# EasyEDA Pro project ProPrj_F1C200S_2026-01-27.epro, board PCB1
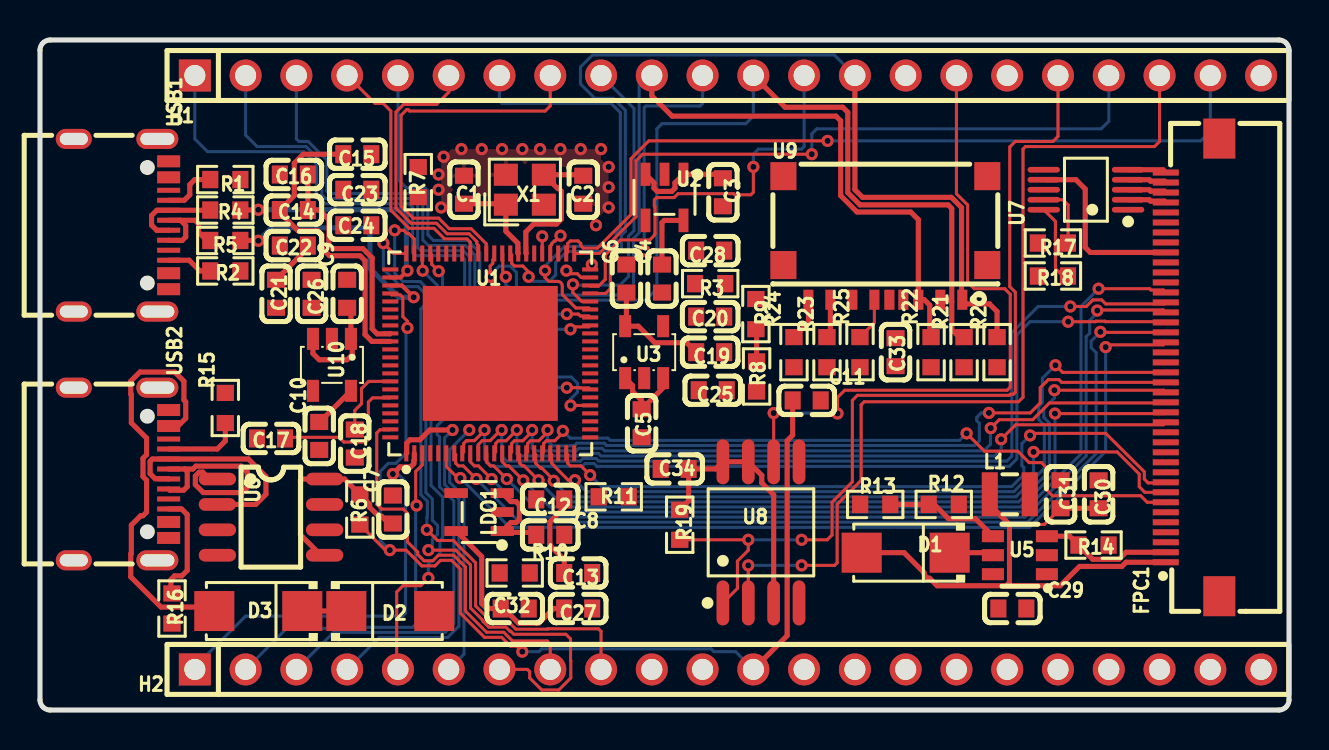
[diagram p1: board, top side]
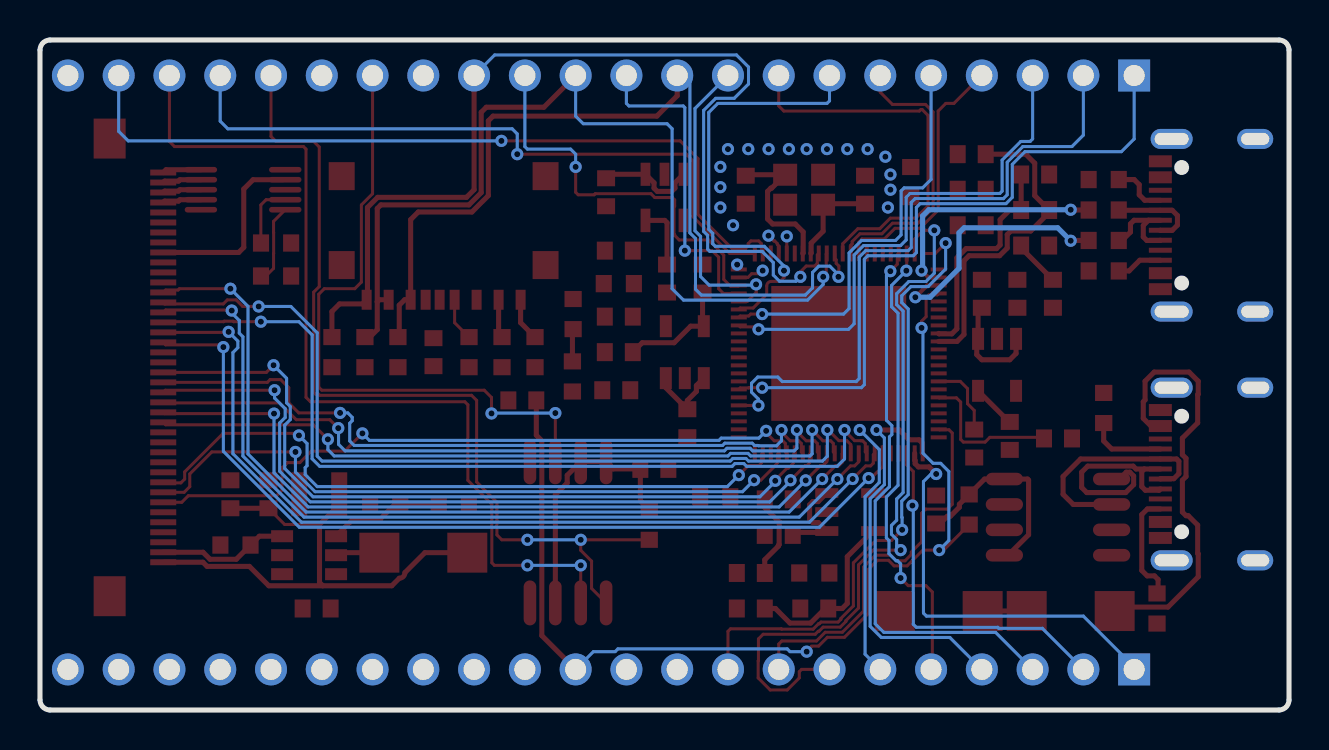
[diagram p2: board, bottom side, seen from below]

Outline 62.48 x 33.53 mm; copper layers: Top Layer, Inner1, Inner2, Bottom Layer. Coordinates in mm from the lower left corner of the outline.
Outline path: 0,33.02 0,0.51 arc(0.15,0.15) 0.51,0 61.98,0 arc(62.34,0.15) 62.48,0.51 62.48,33.02 arc(62.34,33.38) 61.98,33.53 0.51,33.53 arc(0.15,33.38) 0,33.02
Stack: Top Layer 0.035mm Outer layer thickness 1oz / Dielectric1 0.2104mm 7628 RC49% 8.6mil / Inner1 0.0152mm Inner layer thickness / Dielectric2 1.065mm 1.1mm H/HOZ Copper / Inner2 0.0152mm Inner layer thickness / Dielectric3 0.2104mm 7628 RC49% 8.6mil / Bottom Layer 0.035mm Outer layer thickness 1oz

## Design rules (mm)
net D1-: DP3
net D1+: DP3
net USB_DM: DP4
net USB_DP: DP4
spacing copperThickness1oz (default): track to track 0.102, other pairs 0.102 to 0.3
spacing copperThickness2oz: track to track 0.203, other pairs 0.152 to 0.3
track width copperThickness1oz (default): min 0.127, default 0.152, max 2.54
track width copperThickness2oz: min 0.203, default 0.254, max 2.54
differential pair differentialPair (default): width min 0.127, default 0.254, max 2.54; gap min 0.152, default 0.152
net GND uses copperRegion

## Placement (name value [footprint] x y rotation side)
C1  22pF  [C0603]  21.21 26.04 90 top
C2  22pF  [C0603]  27.18 26.04 90 top
C3  1uF  [C0603]  34.16 25.91 90 top
C4  10uF  [C0603]  31.12 21.59 90 top
C5  1uF  [C0603]  30.1 14.35 90 top
C6  10uF  [C0603]  29.34 21.59 270 top
C7  10uF  [C0603]  17.65 10.03 270 top
C8  1uF  [C0603]  25.53 8.76 180 top
C9  1uF  [C0603]  15.37 20.83 270 top
C10  10uF  [C0603]  13.97 13.72 90 top
C11  100nF  [C0603]  38.35 15.49 0 top
C12  100nF  [C0603]  25.53 10.54 0 top
C13  100nF  [C0603]  26.92 6.86 0 top
C14  10uF  [C0603]  12.7 25.02 0 top
C15  10uF  [C0603]  15.88 27.81 180 top
C16  10uF  [C0603]  12.7 26.8 0 top
C17  1uF  [C0603]  11.56 13.59 0 top
C18  1uF  [C0603]  15.75 13.34 90 top
C19  100nF  [C0603]  33.53 17.91 180 top
C20  1uF  [C0603]  33.53 19.69 180 top
C21  100nF  [C0603]  11.81 20.83 90 top
C22  10uF  [C0603]  12.7 23.24 0 top
C23  100nF  [C0603]  15.88 26.04 0 top
C24  10uF  [C0603]  15.88 24.26 0 top
C25  100nF  [C0603]  33.66 16 180 top
C26  100nF  [C0603]  13.59 20.83 270 top
C27  10uF  [C0603]  26.92 5.08 180 top
C28  100nF  [C0603]  33.53 22.99 180 top
C29  10uF  [C0603]  48.64 5.08 180 top
C30  10uF  [C0603]  52.96 10.8 90 top
C31  100nF  [C0603]  51.05 10.8 90 top
C32  100nF  [C0603]  23.75 5.08 180 top
C33  10uF  [C0603]  42.8 17.91 270 top
C34  100nF  [C0603]  31.75 12.07 0 top
D1  SS14  [SMA_L4.3-W2.6-LS5.2-RD]  43.31 7.87 180 top
D2  SS14  [SMA_L4.3-W2.6-LS5.2-RD]  17.53 4.95 0 top
D3  SS14  [SMA_L4.3-W2.6-LS5.2-RD]  10.92 4.95 180 top
FPC1  AFC01-S40FCA-00  [FPC-SMD_AFC01-S40FCA-00]  57.66 17.15 90 top
H1  X6511WV-22H-C60D30  [HDR-TH_22P-P2.54-V-M]  34.42 31.75 0 top
H2  X6511WV-22H-C60D30  [HDR-TH_22P-P2.54-V-M]  34.42 2.03 0 top
L1  2.2uH  [IND-SMD_L2.5-W2.0_MHCHL2520]  48.51 10.8 0 top
LDO1  ME6211C33M5G-N  [SOT-23-5_L3.0-W1.7-P0.95-LS2.8-BL]  21.97 9.91 90 top
R1  5.1kΩ  [R0603]  9.27 26.54 180 top
R2  5.1kΩ  [R0603]  9.27 21.97 180 top
R3  47kΩ  [R0603]  33.53 21.34 0 top
R4  22Ω  [R0603]  9.27 25.02 180 top
R5  22Ω  [R0603]  9.27 23.5 180 top
R6  47kΩ  [R0603]  16 10.03 270 top
R7  0Ω  [R0603]  18.92 26.42 90 top
R8  2kΩ  [R0603]  35.85 16.69 90 top
R9  2kΩ  [R0603]  35.81 19.81 90 top
R10  200kΩ  [R0603]  23.75 6.86 180 top
R11  200kΩ  [R0603]  28.7 10.67 0 top
R12  10kΩ  [R0603]  45.21 10.29 180 top
R13  0Ω  [R0603]  41.78 10.29 0 top
R14  5.1Ω  [R0603]  52.71 8.26 180 top
R15  5.1kΩ  [R0603]  9.27 15.11 270 top
R16  5.1kΩ  [R0603]  6.6 5.08 90 top
R17  4.7kΩ  [R0603]  50.67 23.37 0 top
R18  4.7kΩ  [R0603]  50.67 21.72 0 top
R19  10kΩ  [R0603]  32 9.27 90 top
R20  47kΩ  [R0603]  47.88 17.91 270 top
R21  47kΩ  [R0603]  46.23 17.91 270 top
R22  47kΩ  [R0603]  44.58 17.91 270 top
R23  47kΩ  [R0603]  39.37 17.91 270 top
R24  47kΩ  [R0603]  37.72 17.91 270 top
R25  22Ω  [R0603]  41.02 17.91 90 top
U1  F1C200S  [QFN-88_L10.0-W10.0-P0.40-BL-EP6.75]  22.53 17.84 0 top
U2  ME6211C12M5G-N  [SOT-23-5_L3.0-W1.7-P0.95-LS2.8-BL]  31.24 25.65 180 top
U3  ME6211C25M5G-N  [SOT-23-5_L3.0-W1.7-P0.95-LS2.8-BR]  30.23 17.91 270 top
U5  PT4103B23F  [SOT-23-6_L2.9-W1.6-P0.95-LS2.8-BR]  49.02 7.75 0 top
U6  CH340N  [SOP-8_L4.9-W3.9-P1.27-LS6.0-BL]  11.56 9.65 270 top
U7  NS2009  [MSOP-10_L3.0-W3.0-P0.50-LS5.0-BL]  52.32 26.04 90 top
U8  W25Q128JVSIQ  [SOIC-8_L5.3-W5.3-P1.27-LS8.0-BL]  36.07 8.89 0 top
U9  TF-123-ARP9H17  [TF-SMD_TF-123-ARP9H15]  42.29 23.62 0 top
U10  ME6211C28M5G-N  [SOT-23-5_L3.0-W1.7-P0.95-LS2.8-BR]  14.61 17.27 90 top
USB1  MC-107DMS  [USB-C-SMD_MC-107DMS]  4.06 24.26 270 top
USB2  MC-107DMS  [USB-C-SMD_MC-107DMS]  4.06 11.81 270 top
X1  24MHz  [CRYSTAL-SMD_4P-L2.5-W2.0-BL]  24.26 26.04 0 top

## Footprints (pads in the part's own frame, mm; a bottom-side part is the same pattern mirrored in y, then rotated)
C0603
  rect 0.8x0.9 smd: 1(-0.7,0) 2(0.7,0)
CRYSTAL-SMD_4P-L2.5-W2.0-BL
  rect 1.2x1.1 smd: 1(-0.95,-0.75) 2(0.95,-0.75) 3(0.95,0.75) 4(-0.95,0.75)
FPC-SMD_AFC01-S40FCA-00
  rect 0.3x1.3 smd: 1(-9.75,1.34) 2(-9.25,1.339) 3(-8.75,1.34) 4(-8.25,1.34) 5(-7.75,1.34) 6(-7.25,1.34) 7(-6.75,1.34) 8(-6.25,1.34) 9(-5.75,1.34) 10(-5.25,1.34) 11(-4.75,1.34) 12(-4.25,1.34) 13(-3.75,1.34) 14(-3.25,1.34) 15(-2.75,1.34) 16(-2.25,1.34) 17(-1.75,1.34) 18(-1.25,1.34) 19(-0.75,1.34) 20(-0.25,1.34) 21(0.25,1.34) 22(0.75,1.34) 23(1.25,1.34) 24(1.75,1.34) 25(2.25,1.34) 26(2.75,1.34) 27(3.25,1.34) 28(3.75,1.34) 29(4.25,1.34) 30(4.75,1.34) 31(5.25,1.34) 32(5.75,1.34) 33(6.25,1.34) 34(6.75,1.34) 35(7.25,1.34) 36(7.75,1.34) 37(8.25,1.34) 38(8.75,1.34) 39(9.25,1.34) 40(9.75,1.34)
  rect 2x1.6 smd: 41(-11.45,-1.34) 42(11.45,-1.34)
HDR-TH_22P-P2.54-V-M
  rect 1.6x1.6 hole 1.05: 1(-26.67,0)
  round 1.6 hole 1.05: 2(-24.13,0) 3(-21.59,0) 4(-19.05,0) 5(-16.51,0) 6(-13.97,0) 7(-11.43,0) 8(-8.89,0) 9(-6.35,0) 10(-3.81,0) 11(-1.27,0) 12(1.27,0) 13(3.81,0) 14(6.35,0) 15(8.89,0) 16(11.43,0) 17(13.97,0) 18(16.51,0) 19(19.05,0) 20(21.59,0) 21(24.13,0) 22(26.67,0)
IND-SMD_L2.5-W2.0_MHCHL2520
  rect 0.8x2.2 smd: 1(-1,0) 2(1,0)
MSOP-10_L3.0-W3.0-P0.50-LS5.0-BL
  oval 0.28x1.62 smd: 1(-1,-2.11) 2(-0.5,-2.11) 3(0,-2.11) 4(0.5,-2.11) 5(1,-2.11) 6(1,2.11) 7(0.5,2.11) 8(0,2.11) 9(-0.5,2.11) 10(-1,2.11)
QFN-88_L10.0-W10.0-P0.40-BL-EP6.75
  rect 0.2x0.8 smd: 1(-4.2,-5) 2(-3.8,-5) 3(-3.4,-5) 4(-3,-5) 5(-2.6,-5) 6(-2.2,-5) 7(-1.8,-5) 8(-1.4,-5) 9(-1,-5) 10(-0.6,-5) 11(-0.2,-5) 12(0.2,-5) 13(0.6,-5) 14(1,-5) 15(1.4,-5) 16(1.8,-5) 17(2.2,-5) 18(2.6,-5) 19(3,-5) 20(3.4,-5) 21(3.8,-5) 22(4.2,-5) 45(4.2,5) 46(3.8,5) 47(3.4,5) 48(3,5) 49(2.6,5) 50(2.2,5) 51(1.8,5) 52(1.4,5) 53(1,5) 54(0.6,5) 55(0.2,5) 56(-0.2,5) 57(-0.6,5) 58(-1,5) 59(-1.4,5) 60(-1.8,5) 61(-2.2,5) 62(-2.6,5) 63(-3,5) 64(-3.4,5) 65(-3.8,5) 66(-4.2,5)
  rect 0.8x0.2 smd: 23(5,-4.2) 24(5,-3.8) 25(5,-3.4) 26(5,-3) 27(5,-2.6) 28(5,-2.2) 29(5,-1.8) 30(5,-1.4) 31(5,-1) 32(5,-0.6) 33(5,-0.2) 34(5,0.2) 35(5,0.6) 36(5,1) 37(5,1.4) 38(5,1.8) 39(5,2.2) 40(5,2.6) 41(5,3) 42(5,3.4) 43(5,3.8) 44(5,4.2) 67(-5,4.2) 68(-5,3.8) 69(-5,3.4) 70(-5,3) 71(-5,2.6) 72(-5,2.2) 73(-5,1.8) 74(-5,1.4) 75(-5,1) 76(-5,0.6) 77(-5,0.2) 78(-5,-0.2) 79(-5,-0.6) 80(-5,-1) 81(-5,-1.4) 82(-5,-1.8) 83(-5,-2.2) 84(-5,-2.6) 85(-5,-3) 86(-5,-3.4) 87(-5,-3.8) 88(-5,-4.2)
  rect 6.75x6.75 smd: 89(0,0)
R0603
  rect 0.806x0.864 smd: 1(-0.753,0) 2(0.753,0)
SMA_L4.3-W2.6-LS5.2-RD
  rect 2x2 smd: 1(-2.2,0) 2(2.2,0)
SOIC-8_L5.3-W5.3-P1.27-LS8.0-BL
  oval 0.63x2.25 smd: 1(-1.905,-3.53) 2(-0.635,-3.53) 3(0.635,-3.53) 4(1.905,-3.53) 5(1.905,3.53) 6(0.635,3.53) 7(-0.635,3.53) 8(-1.905,3.53)
SOP-8_L4.9-W3.9-P1.27-LS6.0-BL
  oval 0.63x1.865 smd: 1(-1.905,-2.683) 2(-0.635,-2.683) 3(0.635,-2.683) 4(1.905,-2.683) 5(1.905,2.683) 6(0.635,2.683) 7(-0.635,2.683) 8(-1.905,2.683)
SOT-23-5_L3.0-W1.7-P0.95-LS2.8-BL
  rect 0.49x1.157 smd: 1(-0.95,-1.153) 2(0,-1.153) 3(0.95,-1.153)
  rect 0.49x1.175 smd: 4(0.95,1.153) 5(-0.95,1.153)
SOT-23-5_L3.0-W1.7-P0.95-LS2.8-BR
  rect 1.1x0.6 smd: 1(1.3,-0.95) 2(1.3,0) 3(1.3,0.95) 4(-1.3,0.95) 5(-1.3,-0.95)
SOT-23-6_L2.9-W1.6-P0.95-LS2.8-BR
  rect 1.1x0.6 smd: 1(1.35,-0.95) 2(1.35,0) 3(1.35,0.95) 4(-1.35,0.95) 5(-1.35,0) 6(-1.35,-0.95)
TF-SMD_TF-123-ARP9H15
  rect 0.5x1 smd: 1(3.85,-3.092) 2(2.75,-3.092) 3(1.65,-3.092) 4(0.9,-3.092) 5(-0.55,-3.092) 6(-1.65,-3.092) 7(-2.75,-3.092) 8(-3.85,-3.092) 9(0.2,-3.092)
  rect 1.3x1.4 smd: 10(-5.1,-1.357) 11(-5.1,3.092) 12(5.1,3.092) 13(5.1,-1.357)
USB-C-SMD_MC-107DMS
  oval 1x2.1 hole 0.6x1.7: 13(-4.32,1.808) 16(4.32,1.808)
  oval 1x1.8 hole 0.6x1.4: 14(-4.32,-2.373) 15(4.32,-2.373)
  rect 0.6x1.15 smd: A1/B12(-3.2,2.373) A4/B9(-2.4,2.373) B1/A12(3.2,2.373) B4/A9(2.4,2.373)
  rect 0.25x1.15 smd: A5(-1.25,2.373) A6(-0.25,2.373) A7(0.25,2.373) A8(1.25,2.373) B5(1.75,2.373) B6(0.75,2.373) B7(-0.75,2.373) B8(-1.75,2.373)

## Nets
As in the schematic.

Pads without a net: FPC1 35; LDO1 4; U2 4; U3 4; U6 4; U9 9; U10 4; USB1 13 14 15 16; USB2 13 14 15 16 B4/A9 B8

## Via types
v1: diameter 0.61, hole 0.305, Top Layer to Bottom Layer, 87 vias

## Routing (per net, layer and track width the routed paths; a pad name or vN(x,y) marks a point on that pad's centre or on a via; arc(x,y) is an arc through that point)
+1.2V: length 3.2
  Top Layer w0.254: C4.2 31.12,24.38 31.23,24.5 U2.5
+2.5V: length 5.8
  Top Layer w0.254: C19.2 32.36,18.38 30.76,18.38 29.93,19.21 U3.5 29.34,19.27 C6.2
+2.8V: length 2.2
  Top Layer w0.254: C10.2 14,14.42 15.55,15.97
+3.3V: length 32
  Top Layer w0.254: C27.2 25.69,5.08 24.96,4.35 23.93,4.35 23.2,5.08 C32.2 22.35,5.08 22.1,5.33 22.1,7.68 LDO1.5 ; U6.5 14.05,7.75 13.03,8.77 13.03,11.5 13.08,11.56 U6.8 15.23,11.56 R6.1 16.49,10.3 16.49,10.15 16.94,9.7 17.09,9.7 17.46,9.33 C7.2 ; R19.2 32.45,10.47 C34.2 33.81,12.07 U8.8 U8.7 36.11,11.74 36.11,11.36 36.7,10.77 U8.3
+5V: length 18.9
  Top Layer w0.254: U10.3 13.66,17.84 13.97,17.53 15.37,17.53 15.62,17.78 15.62,18.51 15.55,18.57 15.55,19.94 C9.2 ; LDO1.3 23.55,10.43 23.82,10.43 23.98,10.27 23.98,9.55 23.82,9.38 23.55,9.38 LDO1.1 23.19,8.89 24.83,8.89 ; U2.3 30.72,26.38 30.72,26.11 30.88,25.95 31.6,25.95 31.77,26.11 31.77,26.38 U2.1 33.96,26.81 C3.2 ; U3.1 29.65,16.24 29.65,15.94 30.1,15.49 C5.2 31.18,16.13 U3.3
GND:
  vias: v1(19.94,26.8) v1(19.94,26.04) v1(20.07,25.15) v1(20.19,27.69) v1(21.08,28.07) v1(22.1,28.07) v1(23.11,28.07) v1(24.13,28.07) v1(25.02,28.07) v1(26.03,28.07) v1(27.05,28.07) v1(27.81,24.26) v1(28.07,28.07) v1(28.45,27.18) v1(28.45,26.16) v1(28.45,25.15)
CC1: length 2.8
  Top Layer w0.254: R1.2 7.75,26.54 7.49,26.29 7.49,25.78 7.22,25.51 USB1.A5
CC2: length 2.3
  Top Layer w0.254: R2.2 8,21.97 7.47,22.51 USB1.B5
D1+: length 4.6
  Top Layer w0.254: R5.2 8.35,23.5 7.93,23.91 7.93,24.33 7.75,24.51 7.03,24.51 ; USB1.A6 7.03,24.51 ; 7.03,24.51 7.29,24.25 7.29,23.67 7.11,23.5 6.45,23.5 USB1.B6
D1-: length 4.5
  Top Layer w0.254: USB1.A7 6.43,24 5.84,24 5.58,24.26 5.58,24.75 5.84,25.01 USB1.B7 8.34,25.01 8.35,25.02 R4.2
HIPCOMFB: length 20.9
  Top Layer w0.254: U1.2 18.73,12.5 18.7,12.48 18.7,12.33 18.54,12.17 18.01,12.17 v1(17.65,11.81)
  Bottom Layer w0.152: v1(17.65,11.81) 17.91,11.81 18.29,11.43 18.29,4.85 18.14,4.7 10.29,4.7 7.75,2.16 H2.1
HOSCI: length 7.7
  Top Layer w0.254: C2.2 27.13,26.79 X1.3 25.88,26.11 25.92,26.11 26.09,25.95 26.09,24.57 25.83,24.32 24.7,24.32 24.3,23.92 24.3,22.87 U1.51
HOSCO: length 4.8
  Top Layer w0.254: C1.1 23.26,25.34 23.31,25.29 23.31,23.96 23.9,23.36 23.9,22.87 U1.52
HPCOM: length 18.2
  Top Layer w0.152: v1(18.84,10.23) 18.8,10.28 18.8,11.94 19.13,12.27 U1.3
  Bottom Layer w0.152: v1(18.84,10.23) 18.8,10.19 18.8,4.29 18.64,4.14 14.58,4.14 14.52,4.09 12.34,4.09 10.29,2.03
HPL: length 19.8
  Top Layer w0.254: v1(20.64,14.01) 19.49,14.01 19,13.52 18.51,13.52 18.35,13.36 18.35,12.87 U1.1
  Bottom Layer w0.152: H2.4 16.97,3.63 20.4,3.63 20.95,4.19 20.95,10.57 20.24,11.28 20.24,13.62 v1(20.64,14.01)
HPR: length 13
  Bottom Layer w0.152: H2.6 21.21,2.79 21.21,10.67 20.5,11.39 20.5,13.04 v1(21.47,14.01)
LCD_D2: length 44.8
  Top Layer w0.152: v1(53.31,18.16) 53.42,18.27 56.2,18.27 FPC1.23 ; v1(21.03,11.61) 20.91,11.61 20.33,12.19 U1.6
  Bottom Layer w0.152: v1(53.31,18.16) 53.31,12.95 49.51,9.14 23.49,9.14 v1(21.03,11.61)
LCD_D3: length 44.9
  Top Layer w0.152: FPC1.24 53.07,18.9 v1(53.05,18.92) ; U1.7 20.8,12.77 20.8,12.35 20.93,12.22 21.18,12.22 v1(21.83,11.56)
  Bottom Layer w0.152: v1(53.05,18.92) 52.59,18.46 52.59,18.13 52.83,17.89 52.83,12.83 49.4,9.4 23.99,9.4 v1(21.83,11.56)
LCD_D4: length 44.3
  Top Layer w0.152: v1(22.24,14.01) 22.24,13.98 21.73,13.48 21.42,13.48 21.41,13.47 21.33,13.47 21.2,13.34 21.2,12.92 U1.8 ; FPC1.25 56.28,19.43 53.29,19.43 53.27,19.46 52.83,19.46 52.8,19.43 v1(51.44,19.43)
  Bottom Layer w0.152: v1(22.24,14.01) 22.24,12.56 22.61,12.19 27.13,12.19 27.28,12.33 27.72,12.33 27.86,12.19 48.49,12.19 48.87,12.57 48.87,18.77 49.53,19.43 v1(51.44,19.43)
LCD_D5: length 44.6
  Top Layer w0.152: FPC1.26 56.2,20.02 52.92,20.02 v1(52.89,19.99) ; U1.9 21.53,12.42 21.73,12.22 21.94,12.22 v1(22.59,11.56)
  Bottom Layer w0.152: v1(52.89,19.99) 52.89,19.87 52.51,19.49 52.51,18.86 52.33,18.68 52.33,12.71 49.28,9.65 24.5,9.65 v1(22.59,11.56)
LCD_D6: length 43.8
  Top Layer w0.152: 23.09,14.05 22.52,13.48 22.12,13.48 21.93,13.28 U1.10 ; 51.55,20.19 52.34,20.19 52.67,20.52 53.11,20.52 53.31,20.32 56.24,20.32 FPC1.27
  Bottom Layer w0.152: 23.09,14.05 23.09,12.7 23.34,12.46 27.04,12.46 27.17,12.59 27.82,12.59 27.95,12.46 48.37,12.46 48.62,12.7 48.62,18.88 49.93,20.19 51.55,20.19
  vias: v1(23.09,14.01) v1(51.54,20.19)
LCD_D7: length 44.5
  Top Layer w0.152: v1(23.35,11.56) 22.7,12.22 22.53,12.22 22.35,12.4 22.35,12.82 U1.11 ; FPC1.28 56.2,21.02 55.57,21.02 55.51,21.08 v1(52.96,21.08)
  Bottom Layer w0.152: v1(23.35,11.56) 25.01,9.91 49.17,9.91 52.08,12.81 52.08,20.2 v1(52.96,21.08)
LCD_D10: length 36.7
  Top Layer w0.152: FPC1.15 56.2,14.27 48.81,14.27 v1(48.08,13.55) ; v1(23.86,14.01) 23.32,13.47 22.93,13.47 22.8,13.34 22.8,12.92 U1.12
  Bottom Layer w0.152: v1(48.08,13.55) 48.08,13.03 47.76,12.71 28.07,12.71 27.94,12.84 27.06,12.84 26.93,12.71 23.97,12.71 23.86,12.82 v1(23.86,14.01)
LCD_D11: length 38.2
  Top Layer w0.152: FPC1.16 56.26,14.83 v1(50.78,14.83) ; v1(24.18,11.49) 23.45,12.22 23.33,12.22 23.13,12.42 U1.13
  Bottom Layer w0.152: v1(24.18,11.49) 25.51,10.16 49.07,10.16 50.78,11.87 v1(50.78,14.83)
LCD_D12: length 36.1
  Top Layer w0.152: U1.14 23.6,12.92 23.6,13.34 23.73,13.47 24.15,13.47 24.62,13.94 v1(24.62,14.01) ; FPC1.17 56.29,15.37 50.5,15.37 49.66,14.53 47.98,14.53 v1(47.56,14.11)
  Bottom Layer w0.152: v1(47.56,14.11) 47.55,14.09 47.55,13.3 47.22,12.97 28.25,12.97 28.12,13.1 26.96,13.1 26.83,12.97 24.75,12.97 24.62,13.1 v1(24.62,14.01)
LCD_D13: length 38.5
  Top Layer w0.152: v1(50.75,16) 56.21,16 FPC1.18 ; v1(24.94,11.5) 24.22,12.22 24.13,12.22 24,12.35 24,12.77 U1.15
  Bottom Layer w0.152: v1(50.75,16) 50.75,15.61 50.22,15.08 50.22,14.64 50.5,14.36 50.5,11.95 48.96,10.42 25.98,10.42 24.94,11.45 v1(24.94,11.5)
LCD_D14: length 36.3
  Top Layer w0.152: FPC1.19 51.11,16.4 50.97,16.54 50.44,16.54 50.04,16.13 50.04,15.37 49.54,14.87 v1(47.47,14.87) ; U1.16 24.4,12.92 24.4,13.34 24.53,13.47 24.95,13.47 25.39,13.91 v1(25.39,14.01)
  Bottom Layer w0.152: v1(47.47,14.87) 47.09,14.87 46.86,14.65 46.86,14.48 46.99,14.35 46.99,13.46 46.77,13.24 28.34,13.24 28.22,13.35 26.85,13.35 26.74,13.24 26.56,13.24 26.54,13.22 25.64,13.22 25.39,13.47 v1(25.39,14.01)
LCD_D15: length 38.6
  Top Layer w0.152: v1(25.7,11.47) 25.7,11.51 25.1,12.11 25.04,12.11 24.8,12.35 24.8,12.77 U1.17 ; v1(50.8,17.25) 51.16,16.9 FPC1.20
  Bottom Layer w0.152: v1(25.7,11.47) 25.7,11.44 26.47,10.67 48.82,10.67 50.24,12.09 50.24,14.25 49.96,14.53 49.96,15.19 50.15,15.37 50.15,16.6 v1(50.8,17.25)
LCD_D18: length 34.4
  Top Layer w0.152: FPC1.7 55.39,10.4 55.06,10.72 50.65,10.72 50.38,11 50.38,12.11 50.1,12.38 49.48,12.38 48.91,12.95 47.24,12.95 v1(46.35,13.84) ; U1.18 25.2,12.92 25.2,13.34 25.33,13.47 25.75,13.47 26.16,13.88 v1(26.16,13.97)
  Bottom Layer w0.152: v1(26.16,13.97) 26.52,13.61 28.4,13.61 28.52,13.49 46,13.49 v1(46.35,13.84)
LCD_D19: length 34.5
  Top Layer w0.152: FPC1.8 55.27,10.9 54.99,11.18 54.99,11.81 53.89,12.91 v1(49.7,12.91) ; U1.19 25.6,12.77 25.6,12.35 25.73,12.22 25.73,12.2 26.43,11.5 v1(26.76,11.5)
  Bottom Layer w0.152: v1(26.76,11.5) 27.34,10.92 48.72,10.92 49.7,11.91 v1(49.7,12.91)
LCD_D20: length 34.3
  Top Layer w0.152: FPC1.9 56.29,11.37 55.44,11.37 55.25,11.56 55.25,11.92 53.32,13.84 49.63,13.84 v1(49.53,13.74) ; U1.21 26.4,12.77 26.4,12.35 26.53,12.22 27.06,12.22 v1(27.52,11.75)
  Bottom Layer w0.152: v1(49.53,13.74) 49.12,13.33 49.12,12.23 49.22,12.13 49.22,11.78 48.61,11.18 28.1,11.18 v1(27.52,11.75)
LCD_DE: length 33
  Top Layer w0.152: v1(26.54,15.24) 27.52,15.24 U1.27
  Bottom Layer w0.152: 10.29,31.75 10.29,28.77 10.86,28.19 13.31,28.19 14.1,27.41 14.1,25.78 14.29,25.59 18.71,25.59 18.9,25.4 18.9,23.14 19.05,22.99 21.18,22.99 21.5,22.66 21.5,16.59 21.65,16.44 25.35,16.44 25.57,16.66 26.58,16.66 26.89,16.35 26.89,15.91 26.54,15.56 v1(26.54,15.24)
LCD_HSYNC: length 9.3
  Top Layer w0.254: 56.44,22.9 52.54,22.9 52.29,23.15 52.29,26.07 51.82,26.54 50.34,26.54
LCD_VSYNC: length 34.1
  Top Layer w0.152: v1(26.36,16.13) 27.02,16.13 27.03,16.12 27.45,16.12 U1.29
  Bottom Layer w0.152: H1.1 7.75,28.58 8.38,27.94 13.21,27.94 13.84,27.31 13.84,25.65 14.16,25.34 18.45,25.34 18.64,25.15 18.64,22.89 18.8,22.73 21.07,22.73 21.25,22.56 21.25,16.28 21.4,16.13 v1(26.36,16.13)
MICIN: length 19.6
  Top Layer w0.152: H2.8 25.53,3.3 25.37,3.45 23.64,3.45 23.2,3.89 22.34,3.89 21.28,4.95 21.28,7.16 20.69,7.75 19.93,7.75 19.65,7.47 19.21,7.47 18.9,7.78 18.9,7.9 18.38,8.42 18.38,9.85 18.18,10.05 17.09,10.05 16.85,10.3 16.85,13.86 17.01,14.02 17.49,14.02 17.51,14.04 U1.87
PA0: length 31.4
  Top Layer w0.152: H2.9 28.07,3.94 27.94,4.06 25.4,4.06 25.38,4.05 23.81,4.05 23.53,4.32 23.5,4.32 23.41,4.4 22.55,4.4 22.42,4.54 22.42,4.58 21.79,5.21 21.79,7.37 20.68,8.48 19.89,8.48 v1(19.35,9.02) ; U1.66 17.7,22.84 v1(17.18,23.36)
  Bottom Layer w0.152: v1(19.35,9.02) 19.35,9.63 19.37,9.65 19.37,10.45 19.05,10.78 19.05,20.07 19.37,20.39 19.37,20.73 18.91,21.19 18.06,21.19 17.18,22.07 v1(17.18,23.36)
PA1: length 36.4
  Top Layer w0.152: H2.7 24.38,2.03 24.5,1.92 24.5,1.61 25.1,1 25.95,1 26.56,1.61 26.56,2.46 26.54,2.47 26.54,3.56 26.31,3.79 23.7,3.79 23.55,3.94 23.51,3.94 23.31,4.15 22.45,4.15 22.17,4.43 22.17,4.47 21.54,5.1 21.54,7.26 20.8,8 v1(19.43,8) ; U1.65 18.73,23.57 18.44,23.85 18.35,23.85 18.2,24 v1(17.75,24)
  Bottom Layer w0.152: v1(19.43,8) 19.63,8.2 19.63,8.54 19.89,8.8 19.89,9.24 19.63,9.5 19.63,10.56 19.3,10.88 19.3,19.96 19.63,20.29 19.63,20.83 19.02,21.44 18.16,21.44 17.75,21.86 v1(17.75,24)
PA2: length 23
  Top Layer w0.152: v1(19.14,21.98) 19.13,22 U1.64 ; v1(19.43,6.6) 19.05,6.22 18.16,6.22 17.84,5.91 17.84,2.1 H2.5
  Bottom Layer w0.152: v1(19.14,21.98) 19.88,21.25 19.88,20.18 19.56,19.86 19.56,11.25 20.14,10.66 20.14,8.61 20.01,8.48 20.01,7.83 19.65,7.47 19.58,7.47 19.43,7.32 v1(19.43,6.6)
PA3: length 28.1
  Top Layer w0.152: U1.63 19.6,22.77 19.6,22.31 v1(19.94,21.96)
  Bottom Layer w0.152: H2.3 14.68,3.89 20.27,3.89 20.7,4.32 20.7,10.46 19.99,11.17 19.99,13.67 19.87,13.79 19.87,14.23 20.14,14.5 20.14,21.77 v1(19.94,21.96)
PC0: length 32.9
  Top Layer w0.152: v1(39.9,14.84) 39.9,15.64 40.26,16 48.39,16 48.54,16.15 48.54,20.8 48.26,21.08 46.74,21.08 46.41,21.41 46.41,25.27 45.85,25.83 H1.16 ; v1(36.7,14.86) U8.6
  Bottom Layer w0.152: v1(39.9,14.84) 39.88,14.86 v1(36.7,14.86)
PC1: length 44.9
  Top Layer w0.152: U8.1 34.89,6.09 34.89,7.45 35.43,7.99 v1(35.43,8.52) R19.1 ; H1.18 50.93,28.7 50.67,28.45 48.79,28.45 48.51,28.17 48.51,21.19 48.79,20.91 48.79,15.9 48.7,15.81 48.55,15.81 48.49,15.75 40.89,15.75 40.64,15.49 40.64,11.42 39.62,10.4 39.62,8.76 39.38,8.52 v1(38.1,8.52)
  Bottom Layer w0.152: v1(35.43,8.52) v1(38.1,8.52)
PC2: length 45.7
  Top Layer w0.152: H1.20 56.01,28.45 55.75,28.19 49.3,28.19 49.18,28.07 49.18,15.65 48.95,15.42 41.23,15.42 41.08,15.27 41.08,11.49 39.88,10.29 39.88,7.37 39.75,7.24 v1(38.1,7.24) ; v1(35.43,7.24) U8.2
  Bottom Layer w0.152: v1(35.43,7.24) v1(38.1,7.24)
PE0: length 0.9
  Top Layer w0.152: U1.49 v1(25.13,23.7)
PE1: length 1.1
  Top Layer w0.152: U1.48 25.53,23.22 25.6,23.29 25.6,23.34 25.73,23.47 25.78,23.47 v1(26.04,23.74)
PE3: length 39.8
  Top Layer w0.152: U1.46 26.4,22.92 26.4,23.34 26.53,23.47 26.92,23.47 27.05,23.34 27.05,23.24 27.18,23.11 27.89,23.11 29.56,24.79 29.56,27.59 30.46,28.48 v1(39.4,28.48)
  Bottom Layer w0.152: v1(39.4,28.48) 58.07,28.48 58.55,28.96 H1.21
PE4: length 34
  Top Layer w0.152: U1.45 27.98,22.84 29.82,24.69 29.82,27.48 30.15,27.81 v1(38.61,27.81)
  Bottom Layer w0.152: H1.19 53.47,29.46 53.09,29.08 38.86,29.08 38.61,28.83 v1(38.61,27.81)
PE5: length 0.3
  Top Layer w0.152: U1.44 27.61,22.13 v1(27.61,22.29)
PE6: length 1.3
  Top Layer w0.152: U1.43 27.07,21.64 26.88,21.83 26.49,21.83 v1(26.33,21.99)
PE7: length 20.1
  Top Layer w0.152: v1(35.69,27.18) 35.69,25.91 35.56,25.78 34.76,25.78 34.71,25.84 31.92,25.84 31.73,25.65 30.85,25.65 30.73,25.53 30.73,25.21 30.76,25.18 30.76,23.82 30.73,23.79 30.73,23.75 30.51,23.52 29.03,23.52 28.28,22.76 28.28,21.55 27.94,21.21 27.56,21.21 U1.42
  Bottom Layer w0.152: H1.13 38.23,28.19 38.1,28.07 35.94,28.07 35.69,27.81 v1(35.69,27.18)
PE8: length 16.1
  Top Layer w0.152: U1.41 28.29,20.84 28.53,21.08 28.53,22.66 28.86,22.99 v1(30.23,22.99)
  Bottom Layer w0.152: v1(30.23,22.99) 30.23,30.15 30.3,30.23 33.02,30.23 33.15,30.35 H1.11
PE9: length 15.2
  Top Layer w0.152: 26.65,21.26 26.65,20.89 27.1,20.44 U1.40
  Bottom Layer w0.152: H1.9 29.72,30.1 29.72,23.98 29.44,23.7 29.44,21.69 29.01,21.26 26.65,21.26
  vias: v1(26.66,21.3)
PE10: length 22
  Top Layer w0.152: U1.39 27.45,20.12 26.81,20.12 26.13,20.8 26.13,21.22 ; v1(25.26,21.99) 25.26,21.63 25.45,21.45 25.9,21.45 arc(26.06,21.38) 26.13,21.22
  Bottom Layer w0.152: v1(25.26,21.99) 25.26,22.22 26.25,23.2 28.7,23.2 28.83,23.33 28.83,23.85 29.03,24.06 29.03,29.9 28.57,30.35 23.11,30.35 22.99,30.48 H1.7
PE11: length 24.6
  Top Layer w0.152: v1(26.36,19.81) 26.94,19.81 27.03,19.72 27.45,19.72 U1.38 ; U7.10 50.8,24.45 50.8,23.9 50.79,23.89 50.79,22.84 50.8,22.84 50.8,22.1 51.18,21.72 R18.2
  Bottom Layer w0.152: v1(26.36,19.81) 22.29,19.81 22.01,20.09 22.01,22.87 21.39,23.5 19.68,23.5 19.41,23.77 19.41,25.98 19.25,26.13 18.33,26.13 17.91,26.55 H1.5
PE12: length 29.3
  Top Layer w0.152: R17.2 51.44,23.38 51.44,25.27 51.17,25.54 U7.9 ; v1(26.54,19.05) 26.66,19.17 27.45,19.17 U1.37
  Bottom Layer w0.152: H1.3 12.83,28.58 12.95,28.45 13.42,28.45 14.35,27.52 14.35,25.96 14.47,25.85 18.96,25.85 19.15,25.65 19.15,23.52 19.43,23.24 21.28,23.24 21.75,22.77 21.75,19.33 22.03,19.05 v1(26.54,19.05)
PF0: length 15.3
  Top Layer w0.152: H1.4 16.76,30.35 17.17,30.35 17.55,29.97 17.55,25.01 18.46,24.1 19.71,24.1 20.24,23.57 21.36,23.57 21.53,23.41 U1.58
  Top Layer w0.254: R24.1 38.44,19.38 U9.8
PF1: length 16
  Top Layer w0.152: H1.6 20.45,30.91 19.84,30.3 18.19,30.3 17.81,29.92 17.81,25.12 18.57,24.36 19.84,24.36 20.37,23.83 21.47,23.83 21.85,23.44 21.85,23.33 21.93,23.26 U1.57
  Top Layer w0.254: U9.7 39.54,18.83 R23.1
PF2: length 19.3
  Top Layer w0.152: H1.8 25.53,30.23 25.27,29.97 18.49,29.97 18.41,30.05 18.35,30.05 18.06,29.75 18.06,25.22 18.67,24.61 19.94,24.61 20.47,24.08 21.57,24.08 22.33,23.33 U1.56
PF3: length 46.6
  Top Layer w0.152: U1.55 22.73,22.6 22.65,22.53 22.65,22.35 22.52,22.22 22.52,21.7 v1(22.54,21.68)
  Top Layer w0.254: H1.10 30.61,30.73 31.62,29.72 39.82,29.72 40.06,29.48 40.06,25.74 40.88,24.92 43.56,24.92 43.94,24.54 U9.3 44.24,20.53 44.51,20.26 44.51,18.73 R22.1
  Bottom Layer w0.152: H1.10 30.12,31.75 29.97,31.6 29.97,23.88 29.69,23.6 29.69,21.06 29.4,20.76 24.19,20.76 23.84,21.12 23.84,21.9 23.52,22.21 22.97,22.21 22.54,21.78 v1(22.54,21.68)
PF4: length 47.3
  Top Layer w0.152: v1(23.3,21.68) 23.15,21.83 23.15,22.82 U1.54
  Top Layer w0.254: U9.2 45.51,20.53 45.61,20.43 ; 45.61,20.43 45.61,19.03 45.98,18.66 R21.1 ; 45.61,20.43 45.61,25.1 45.43,25.28 41.02,25.28 40.41,25.89 40.41,29.91 40.16,30.16 37.27,30.16 H1.12
  Bottom Layer w0.152: v1(23.3,21.68) 23.3,21.3 24.09,20.51 30.29,20.51 30.86,21.08 30.86,29.08 31.12,29.34 35.31,29.34 35.69,29.72 H1.12
PF5: length 51.9
  Top Layer w0.152: U1.53 23.6,22.77 23.6,22.35 23.73,22.22 24.15,22.22 24.45,21.92 v1(24.45,21.68)
  Top Layer w0.254: R20.1 47.88,19.94 47.5,20.32 46.35,20.32 U9.1 46.1,20.57 46.1,25.15 45.59,25.65 41.15,25.65 40.77,26.04 H1.14
  Bottom Layer w0.152: H1.14 39.74,32.78 27.64,32.78 27.04,32.18 27.04,31.32 27.76,30.61 28.68,30.61 29.28,30 29.28,23.95 29.08,23.75 29.08,23.06 28.97,22.95 26.36,22.95 25.8,22.39 25.8,21.77 25.49,21.45 24.67,21.45 v1(24.45,21.68)
RESET: length 53
  Top Layer w0.152: R6.2 17.28,8 v1(17.5,8) 18.32,8 19.1,7.21 19.76,7.21 20.04,7.49 20.59,7.49 21.03,7.05 21.03,4.85 22.24,3.64 23.09,3.64 23.53,3.2 23.89,3.2 ; U1.70 17.6,20.77 18.02,20.77 18.15,20.64 18.15,19.69 18.38,19.46 v1(18.38,19.12) ; 23.88,3.18 v1(24.13,2.92)
  Top Layer w0.254: H2.12 37.38,3.72 37.38,13.48 37.65,13.75 C11.1
  Bottom Layer w0.152: v1(18.38,19.12) 18.31,19.05 18.31,12.85 17.81,12.34 17.42,12.34 17.02,11.94 17.02,8.48 v1(17.5,8) ; H2.12 34.8,2.92 33.71,2.92 33.57,3.06 25.1,3.06 24.96,2.92 v1(24.13,2.92)
SVREF: length 1.6
  Top Layer w0.254: R8.2 35.85,19.02 R9.1
TV_VCC: length 2.4
  Top Layer w0.254: C22.2 13.4,23.12 C21.2
TV_VRN: length 11.3
  Top Layer w0.254: U1.75 17.5,18.82 16.87,18.82 16.62,19.07 16.62,22.63 16.15,23.09 14.63,23.09 14.45,23.27 14.45,24.54 13.97,25.02 C14.2 C16.2
TV_VRP: length 16.2
  Top Layer w0.254: C15.2 13.17,27.81 12.72,27.36 12.72,25.74 C14.1 12,24.89 12.92,23.97 13.92,23.97 14.1,23.79 14.1,23.11 14.48,22.73 16.01,22.73 16.26,22.48 16.26,18.79 16.61,18.44 U1.76
USB_DM: length 12.2
  Top Layer w0.203: v1(18.38,21.99) 18.04,21.64 U1.68
  Top Layer w0.254: v1(10.92,25.03) 10.91,25.02 R4.1
  Bottom Layer w0.254: v1(10.92,25.03) 18.02,25.03 18.33,24.72 18.33,22.04 v1(18.38,21.99)
USB_DP: length 12.8
  Top Layer w0.203: v1(18.69,20.66) 18.1,21.24 U1.69
  Top Layer w0.254: v1(10.92,23.48) 10.91,23.5 R5.1
  Bottom Layer w0.254: v1(18.69,20.66) 17.95,20.66 16.51,22.1 16.51,23.88 16.26,24.13 11.57,24.13 v1(10.92,23.48)
VLED+: length 26.3
  Top Layer w0.152: 48.5,9.28 50.24,9.28 C31.1
  Top Layer w0.254: C31.1 C30.1 ; 47.49,10.77 L1.1 ; 47.49,10.77 47.49,10.8 ; 47.49,10.77 47.49,10.3 48.5,9.28 48.5,6.38 48.34,6.22 ; FPC1.1 54.33,7.4 54.12,7.19 52.01,7.19 51.04,6.22 48.34,6.22 ; 48.34,6.22 44.88,6.22 44.51,6.59 arc(44.31,6.68) 44.23,6.87 43.23,7.87 D1.2
VLED-: length 6.6
  Top Layer w0.254: U5.3 51.51,8.7 R14.2 52.66,7.54 53.98,7.54 54.33,7.9 FPC1.2
VRA1: length 3.8
  Top Layer w0.152: U1.81 16.44,16.44 16.08,16.08 16.08,15.33 15.75,14.99 C18.2
VRA2: length 7.4
  Top Layer w0.152: C17.2 12.31,13.64 14.97,13.64 15.2,13.41 16.29,13.41 16.43,13.54 16.43,15.41 16.64,15.62 17.5,15.62 U1.83
XN: length 1.9
  Top Layer w0.254: FPC1.39 56.25,26.47 55.55,26.47 55.48,26.54 U7.4
XP: length 1.9
  Top Layer w0.254: U7.2 55.48,25.54 55.55,25.47 56.25,25.47 FPC1.37
YN: length 1.9
  Top Layer w0.254: U7.5 56.18,27.04 FPC1.40
YP: length 1.9
  Top Layer w0.254: FPC1.38 56.25,25.97 55.55,25.97 55.48,26.04 U7.3
$1N262: length 4.4
  Top Layer w0.254: C13.1 26.23,6.86 26.23,7.52 25.55,8.2 25.55,8.23 25.51,8.28 25.51,9.41 26.23,10.13 26.23,10.67
$1N279: length 5.8
  Top Layer w0.254: R13.2 R12.2 44.74,10.29 45.45,9.58 46.79,9.58 U5.4
$1N285: length 2.2
  Top Layer w0.254: D1.1 47.54,7.87 U5.5
$1N290: length 2.2
  Top Layer w0.254: 15.58,4.95 15.58,4.96 13.38,4.96 13.38,4.95
$1N291: length 21.7
  Top Layer w0.254: USB2.A4/B9 6.91,14.21 7.29,14.59 7.29,15.43 7.2,15.52 7.2,16.45 6.74,16.91 5,16.91 4.54,16.45 4.54,15.81 4.57,15.78 4.57,14.37 5.33,13.6 5.33,12.77 5.15,12.59 5.15,11.68 5.33,11.5 5.33,9.91 5.15,9.72 5.04,9.72 4.57,9.25 4.57,7.84 4.54,7.81 4.54,6.67 6.06,5.15 8.78,5.15 8.98,4.95
$1N294: length 11.4
  Top Layer w0.254: U6.2 10.8,10.29 11.3,10.8 11.3,11.68 10.43,12.56 USB2.B7 5.62,12.56 5.51,12.45 5.51,11.83 5.76,11.58 6.42,11.58 USB2.A7
$1N295: length 11.5
  Top Layer w0.254: U6.1 8.49,11.56 8.14,11.9 7.96,11.9 7.77,11.71 7.77,11.28 8.17,10.88 10.12,10.88 10.37,11.14 10.37,11.9 10.07,12.21 7.8,12.21 7.65,12.06 7.24,12.06 ; USB2.B6 6.5,11 7.19,11 7.37,11.18 7.37,11.94 7.24,12.06 ; 7.24,12.06 USB2.A6
$1N296: length 3.9
  Top Layer w0.254: R15.2 9.27,13.46 8.87,13.06 USB2.A5
$1N373: length 2.2
  Top Layer w0.152: R25.2 41.74,19.38 U9.5
$1N430: length 5.6
  Top Layer w0.254: R16.2 6.55,5.89 6.55,6.53 6.73,6.71 7.09,6.71 7.37,6.98 7.37,9.78 7.08,10.06 USB2.B5

## Copper pours and planes (outline as drawn; the poured copper is in the pictures)
GND on Top Layer: 20.57,28.07 28.07,28.07 28.07,27.56 28.45,27.18 28.45,25.15 27.81,24.51 20.7,24.51 20.07,25.15 20.07,27.56
